# EAGLE design schematic-both (EAGLE 6.4)
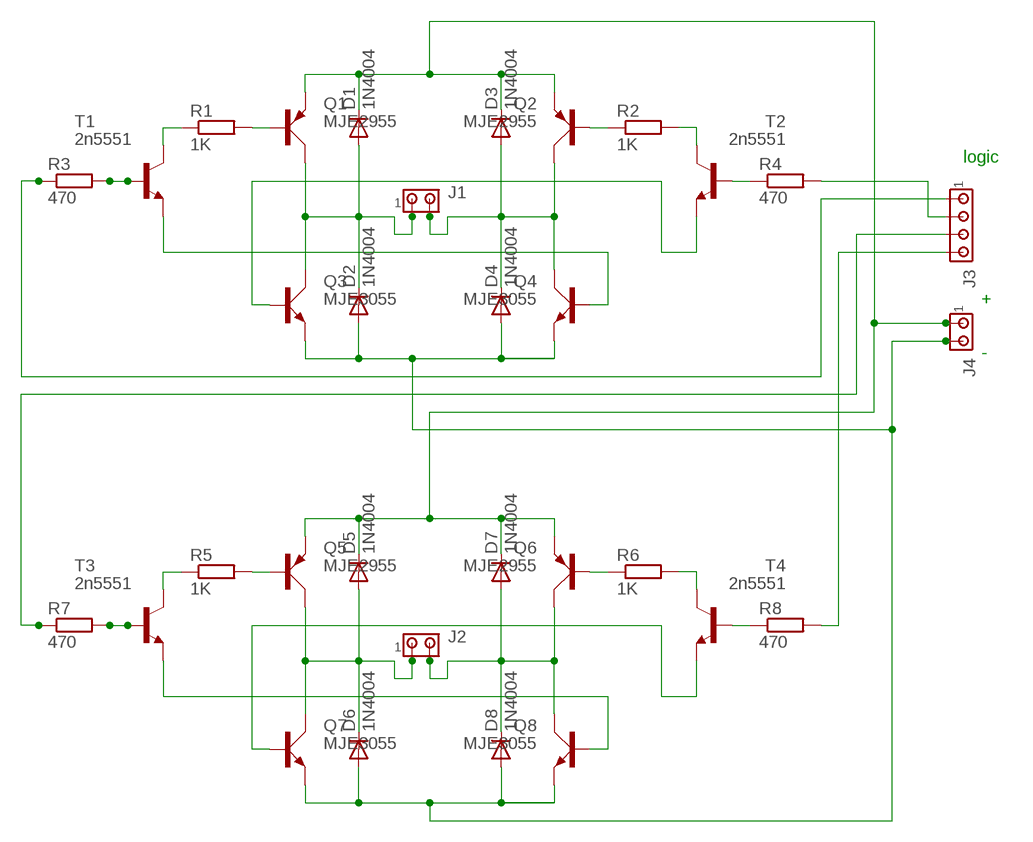
[diagram p0: schematic, sheet 1]

## Parts
D1  1N4004  [DO41-10]
D2  1N4004  [DO41-10]
D3  1N4004  [DO41-10]
D4  1N4004  [DO41-10]
D5  1N4004  [DO41-10]
D6  1N4004  [DO41-10]
D7  1N4004  [DO41-10]
D8  1N4004  [DO41-10]
J1  MTA02-156  [1X2MTA]
J2  MTA02-156  [1X2MTA]
J3  MTA04-100  [10X04MTA]
J4  MTA02-156  [1X2MTA]
Q1  MJE2955  [TO220AV]
Q2  MJE2955  [TO220AV]
Q3  MJE3055  [TO220AV]
Q4  MJE3055  [TO220AV]
Q5  MJE2955  [TO220AV]
Q6  MJE2955  [TO220AV]
Q7  MJE3055  [TO220AV]
Q8  MJE3055  [TO220AV]
R1  1K  R-EU_0204/7  [0204/7]
R2  1K  R-EU_0204/7  [0204/7]
R3  470  R-EU_0204/7  [0204/7]
R4  470  R-EU_0204/7  [0204/7]
R5  1K  R-EU_0204/7  [0204/7]
R6  1K  R-EU_0204/7  [0204/7]
R7  470  R-EU_0204/7  [0204/7]
R8  470  R-EU_0204/7  [0204/7]
T1  2n5551  2N5551-NPN-TO92-EBC  [TO92-EBC]
T2  2n5551  2N5551-NPN-TO92-EBC  [TO92-EBC]
T3  2n5551  2N5551-NPN-TO92-EBC  [TO92-EBC]
T4  2n5551  2N5551-NPN-TO92-EBC  [TO92-EBC]

## Nets
N$1: J3.2 R4.2
N$2: D1.A D2.C J1.1 Q1.C Q3.C
N$3: R1.1 T1.C
N$5: Q1.B R1.2
N$6: D3.A D4.C J1.2 Q2.C Q4.C
N$7: Q2.B R2.1
N$8: R2.2 T2.C
N$9: D1.C D3.C D5.C D7.C J4.1 Q1.E Q2.E Q5.E Q6.E
N$10: Q3.B T2.E
N$11: D5.A D6.C J2.1 Q5.C Q7.C
N$12: R3.2 T1.B
N$13: R4.1 T2.B
N$14: Q4.B T1.E
N$15: D2.A D4.A D6.A D8.A J4.2 Q3.E Q4.E Q7.E Q8.E
N$16: D7.A D8.C J2.2 Q6.C Q8.C
N$17: R5.1 T3.C
N$18: Q5.B R5.2
N$19: Q6.B R6.1
N$20: Q7.B T4.E
N$21: R6.2 T4.C
N$22: R7.2 T3.B
N$23: R8.1 T4.B
N$24: Q8.B T3.E
N$26: J3.1 R3.1
N$27: J3.4 R8.2
N$28: J3.3 R7.1

## Notes on the sheet
- logic
- +
- -

## Library data of the parts
D1-D8 = diode:1N4004: DIODE general purpose rectifier, 1 A
J1 J2 J4 = con-amp:MTA02-156: AMP connector
J3 = con-amp:MTA04-100: AMP connector
Q1 Q2 Q5 Q6 = transistor-power:MJE2955: PNP TRANSISTOR
Q3 Q4 Q7 Q8 = transistor-power:MJE3055: NPN TRANSISTOR
R1-R8 = resistor:R-EU_: RESISTOR, European symbol
T1-T4 = transistor-neu-to92:*-NPN-: NPN Transistror

## Board
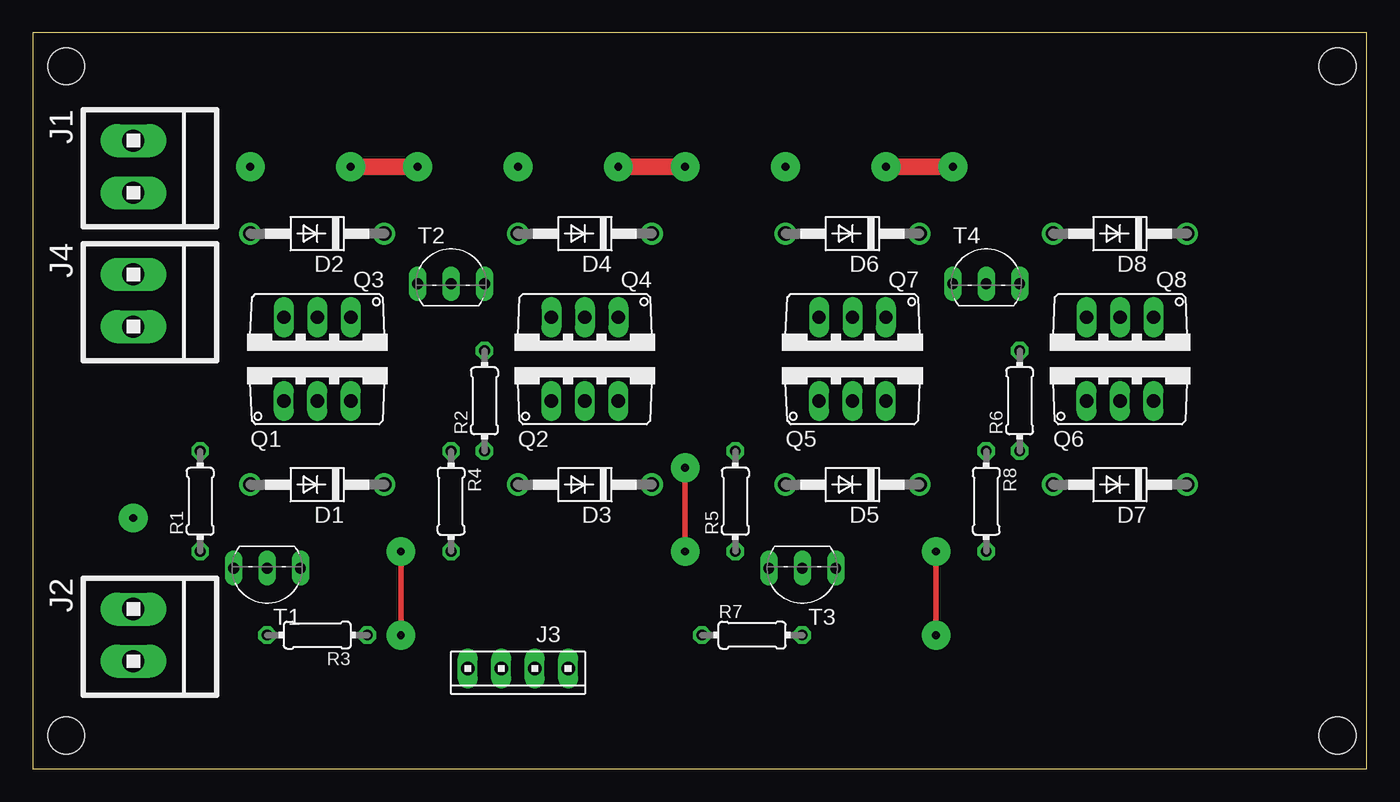
[diagram p1: board, top side]
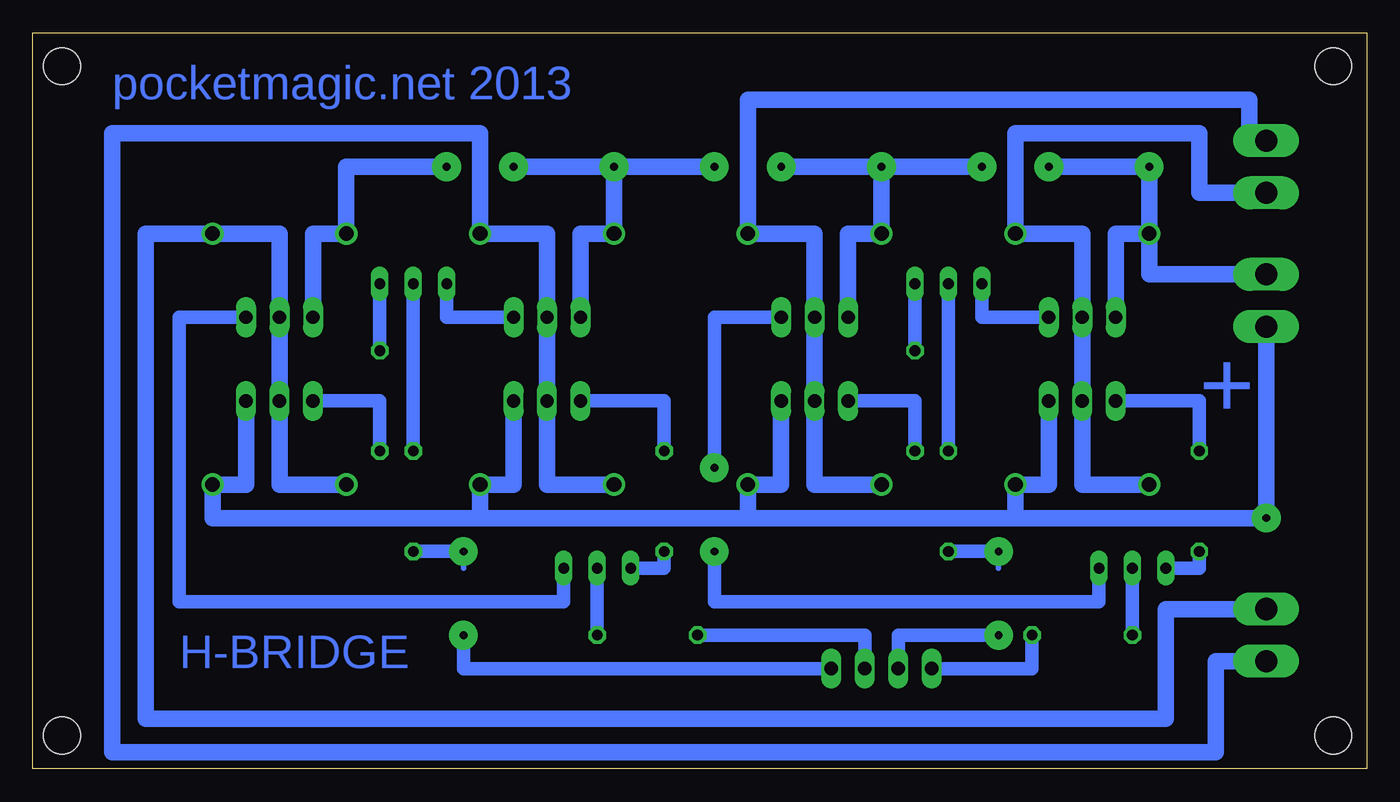
[diagram p2: board, bottom side, seen from below]

Size 101.27 x 55.87 mm. Coordinates in mm from the lower left corner, seen from the top.
Outline: 0,0 101.27,0 101.27,55.87 0,55.87 0,0
Copper layers (1*16): Top 0.035mm / dielectric 1.5mm / Bottom 0.035mm
Design rules "default": minimum track width 10mil, minimum drill 24mil, track to track 8mil, track to pad 8mil, pad to pad 8mil, via to via 8mil, smd to smd 8mil, copper to edge 40mil, drill to drill 8mil, minimum pad ring 10mil, minimum via ring 8mil, stop-mask expansion 4mil, vias tented up to drill 0mil, thermal gap 10mil
Holes 2.8 mm at 2.54,53.34 2.54,2.54 99.06,2.54 99.06,53.34

### Footprints (pad centres in the part's own frame; a part is rotated, then mirrored left to right if it is on the bottom)
DO41-10 = drill 1.118: A 5.08,0; C -5.08,0
1X2MTA = drill 1.676 long: 1 1.981,0; 2 -1.981,0
10X04MTA = drill 1.016 long: 1 3.81,0; 2 1.27,0; 3 -1.27,0; 4 -3.81,0
TO220AV = drill 1.016 long: B -2.54,-2.54; C 0,-2.54; E 2.54,-2.54
0204/7 = drill 0.813 octagon: 1 -3.81,0; 2 3.81,0
TO92-EBC = drill 0.813 long: B 0,-1.27; C 2.54,-1.27; E -2.54,-1.27

### Placement (x,y rotation side)
D1  21.59,21.59 180 top
D2  21.59,40.64 180 top
D3  41.91,21.59 180 top
D4  41.91,40.64 180 top
D5  62.23,21.59 180 top
D6  62.23,40.64 180 top
D7  82.55,21.59 180 top
D8  82.55,40.64 180 top
J1  7.62,45.72 270 top
J2  7.62,10.16 270 top
J3  36.83,7.62 180 top
J4  7.62,35.56 270 top
Q1  21.59,30.48 0 top
Q2  41.91,30.48 0 top
Q3  21.59,31.75 180 top
Q4  41.91,31.75 180 top
Q5  62.23,30.48 0 top
Q6  82.55,30.48 0 top
Q7  62.23,31.75 180 top
Q8  82.55,31.75 180 top
R1  12.7,20.32 90 top
R2  34.29,27.94 90 top
R3  21.59,10.16 180 top
R4  31.75,20.32 270 top
R5  53.34,20.32 90 top
R6  74.93,27.94 90 top
R7  54.61,10.16 0 top
R8  72.39,20.32 270 top
T1  17.78,13.97 180 top
T2  31.75,38.1 0 top
T3  58.42,13.97 180 top
T4  72.39,38.1 0 top

### Tracks (layer width: path | path; a pad name or v marks a point on that pad's centre or on a via)
N$1  (2 unrouted)
  Top 0.406: 27.94,16.51 27.94,15.24 27.94,10.16
  Bottom 0.406: 27.94,16.51 27.94,15.24
  Bottom 1.016: R4.2 27.94,16.51 | J3.2 35.56,10.16 27.94,10.16
N$2
  Bottom 1.27: D1.A 21.59,21.59 Q1.C Q3.C 21.59,40.64 D2.C 26.67,48.26 12.7,48.26 12.7,43.74 J1.1
N$3
  Bottom 1.016: R1.1 12.7,15.24 T1.C
N$4  (via drill 0.6 pad 2.18)
  other vias: 27.94,16.51
N$5
  Bottom 1.016: R1.2 12.7,27.94 Q1.B
N$6
  Bottom 1.27: D3.A 39.37,21.59 41.91,21.59 41.91,22.86 Q2.C Q4.C 41.91,40.64 D4.C 46.99,49.53 46.99,50.8 8.89,50.8 8.89,47.7 J1.2
N$7
  Bottom 1.016: R2.1 34.29,27.94 Q2.B
N$8
  Bottom 1.016: R2.2 T2.C
N$9
  Bottom 0.406: 26.67,19.05 D1.C | 46.99,19.05 D3.C | 67.31,19.05 D5.C
  Bottom 1.27: Q1.E 24.13,21.59 D1.C 26.67,19.05 | Q2.E 44.45,21.59 D3.C 46.99,19.05 | Q5.E 64.77,21.59 D5.C 67.31,19.05 | Q6.E 85.09,21.59 D7.C 87.63,19.05 67.31,19.05 | 26.67,19.05 7.62,19.05 J4.1 | 26.67,19.05 46.99,19.05 | 46.99,19.05 67.31,19.05
N$10
  Bottom 1.016: Q3.B 29.21,34.29 T2.E
N$11
  Bottom 1.27: D5.A 62.23,21.59 Q5.C Q7.C 62.23,40.64 D6.C 67.31,48.26 95.25,48.26 95.25,1.27 11.43,1.27 11.43,7.62 11.43,8.18 J2.1
N$12
  Bottom 1.016: T1.B R3.2
N$13
  Bottom 1.016: R4.1 T2.B
N$14  (2 unrouted)
  Top 0.406: 49.53,22.86 49.53,16.51
  Bottom 1.016: Q4.B 49.53,34.29 49.53,22.86 | T1.E 20.32,12.7 49.53,12.7 49.53,16.51
N$15  (via drill 0.6 pad 2.18)
  Top 0.406: v64.77,45.72 v69.85,45.72
  Top 1.27: v69.85,45.72 v64.77,45.72 | v49.53,45.72 v44.45,45.72 | v29.21,45.72 v24.13,45.72
  Bottom 0.406: Q3.E 19.05,40.64 D2.A 16.51,45.72 | Q8.E 80.01,40.64 D8.A 77.47,45.72
  Bottom 1.27: 57.15,45.72 v64.77,45.72 | v69.85,45.72 77.47,45.72 | Q4.E 39.37,40.64 D4.A 36.83,45.72 | Q7.E 59.69,40.64 D6.A 57.15,45.72 | J4.2 16.51,37.54 D2.A | 16.51,45.72 D2.A | D2.A 19.05,40.64 Q3.E | 77.47,45.72 D8.A | D8.A 80.01,40.64 | 80.01,40.64 Q8.E 80.01,40.64 | 80.01,40.64 D8.A | D8.A 77.47,45.72 | 16.51,45.72 D2.A | D2.A 16.51,45.72 | 16.51,45.72 v24.13,45.72 | 36.83,45.72 v29.21,45.72 | 36.83,45.72 v44.45,45.72 | v49.53,45.72 57.15,45.72
N$16
  Bottom 0.406: 82.55,40.64 D8.C
  Bottom 1.27: D7.A 82.55,21.59 Q6.C Q8.C 82.55,40.64 D8.C 92.71,40.64 92.71,3.81 15.24,3.81 15.24,12.14 J2.2
N$17
  Bottom 1.016: R5.1 53.34,15.24 T3.C
N$18
  Bottom 1.016: R5.2 53.34,27.94 Q5.B
N$19
  Bottom 1.016: R6.1 74.93,27.94 Q6.B
N$20
  Bottom 1.016: Q7.B 69.85,34.29 T4.E
N$21
  Bottom 1.016: R6.2 T4.C
N$22
  Bottom 1.016: R7.2 T3.B
N$23
  Bottom 1.016: R8.1 T4.B
N$24
  Bottom 1.016: Q8.B 90.17,34.29 90.17,22.86 90.17,12.7 60.96,12.7 T3.E
N$25  (via drill 0.6 pad 2.18)
  other vias: 27.94,10.16
N$26
  Bottom 1.016: R3.1 25.4,7.62 J3.1
N$27  (2 unrouted)
  Top 0.406: 68.58,16.51 68.58,15.24 68.58,10.16
  Bottom 0.406: 68.58,16.51 68.58,15.24
  Bottom 1.016: R8.2 68.58,16.51 | J3.4 68.58,7.62 68.58,10.16
N$28
  Bottom 1.016: J3.3 38.1,10.16 R7.1
N$29  (via drill 0.6 pad 2.18)
  other vias: 68.58,16.51
N$30  (via drill 0.6 pad 2.18)
  other vias: 68.58,10.16
N$31  (via drill 0.6 pad 2.18)
  other vias: 16.51,45.72
N$32  (via drill 0.6 pad 2.18)
  other vias: 36.83,45.72
N$33  (via drill 0.6 pad 2.18)
  other vias: 57.15,45.72
N$35  (via drill 0.6 pad 2.18)
  other vias: 7.62,19.05
N$36  (via drill 0.6 pad 2.18)
  other vias: 49.53,22.86
N$37  (via drill 0.6 pad 2.18)
  other vias: 49.53,16.51

### Text on the board
Bottom: pocketmagic.net 2013 | + | H-BRIDGE